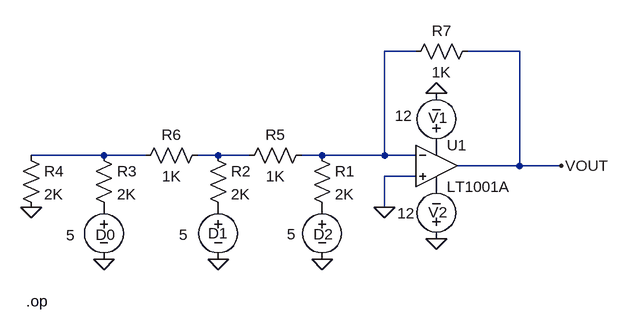
[diagram p0: schematic DAC using OP Amps.asc]
DAC using OP Amps.asc, the LTspice schematic file:
Version 4
SHEET 1 880 680
WIRE 256 16 208 16
WIRE 416 16 336 16
WIRE -224 176 -336 176
WIRE -160 176 -224 176
WIRE -48 176 -80 176
WIRE 0 176 -48 176
WIRE 112 176 80 176
WIRE 208 176 208 16
WIRE 208 176 112 176
WIRE 256 176 208 176
WIRE 416 192 416 16
WIRE 416 192 320 192
WIRE 480 192 416 192
WIRE 256 208 208 208
WIRE 208 256 208 208
FLAG 288 80 0
FLAG 288 304 0
FLAG 208 256 0
FLAG -336 256 0
FLAG 480 192 VOUT
FLAG -224 336 0
FLAG -48 336 0
FLAG 112 336 0
SYMBOL OpAmps\\LT1001A 288 128 R0
SYMATTR InstName U1
SYMBOL voltage 288 176 R180
WINDOW 0 -17 58 Left 2
WINDOW 3 37 61 Left 2
WINDOW 123 0 0 Left 0
WINDOW 39 0 0 Left 0
SYMATTR InstName V1
SYMATTR Value 12
SYMBOL voltage 288 320 R180
WINDOW 0 -17 57 Left 2
WINDOW 3 33 55 Left 2
WINDOW 123 0 0 Left 0
WINDOW 39 0 0 Left 0
SYMATTR InstName V2
SYMATTR Value 12
SYMBOL res 96 160 R0
SYMATTR InstName R1
SYMATTR Value 2K
SYMBOL res -64 160 R0
SYMATTR InstName R2
SYMATTR Value 2K
SYMBOL res -240 160 R0
SYMATTR InstName R3
SYMATTR Value 2K
SYMBOL res -352 160 R0
SYMATTR InstName R4
SYMATTR Value 2K
SYMBOL res 96 160 R90
WINDOW 0 0 56 VBottom 2
WINDOW 3 32 56 VTop 2
SYMATTR InstName R5
SYMATTR Value 1K
SYMBOL res -64 160 R90
WINDOW 0 0 56 VBottom 2
WINDOW 3 32 56 VTop 2
SYMATTR InstName R6
SYMATTR Value 1K
SYMBOL res 352 0 R90
WINDOW 0 0 56 VBottom 2
WINDOW 3 32 56 VTop 2
SYMATTR InstName R7
SYMATTR Value 1K
SYMBOL voltage -224 240 R0
WINDOW 0 -13 58 Left 2
WINDOW 3 -58 59 Left 2
WINDOW 123 0 0 Left 0
WINDOW 39 0 0 Left 0
SYMATTR InstName D0
SYMATTR Value 5
SYMBOL voltage -48 240 R0
WINDOW 0 -16 56 Left 2
WINDOW 3 -60 58 Left 2
WINDOW 123 0 0 Left 0
WINDOW 39 0 0 Left 0
SYMATTR InstName D1
SYMATTR Value 5
SYMBOL voltage 112 240 R0
WINDOW 0 -13 57 Left 2
WINDOW 3 -54 57 Left 2
WINDOW 123 0 0 Left 0
WINDOW 39 0 0 Left 0
SYMATTR InstName D2
SYMATTR Value 5
TEXT -344 400 Left 2 !.op

The netlist it stands for:
* DAC using OP Amps.asc
XU1 0 N001 P001 P002 VOUT LT1001  ; LT1001A, pins In+ In- V+ V- OUT
V1 P001 0 12
V2 0 P002 12
R1 N001 P003 2K
R2 N003 P004 2K
R3 N002 P005 2K
R4 N002 0 2K
R5 N001 N003 1K
R6 N003 N002 1K
R7 VOUT N001 1K
V§D0 P005 0 5
V§D1 P004 0 5
V§D2 P003 0 5
.op
.lib LTC.lib
.backanno
.end